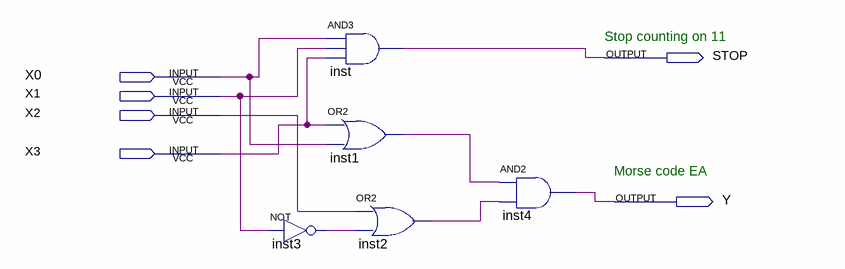
[diagram p0: schematic sheet]
// Quartus schematic KOM2.bdf as structural Verilog: 5 symbols, 6 pins
module KOM2 (
  input  X0,
  input  X1,
  input  X2,
  input  X3,
  output STOP,
  output Y
);

  wire inst1_out, inst2_out, inst3_out;

  and inst (STOP, X0, X1, X3);
  or inst1 (inst1_out, X3, X0);
  not inst3 (inst3_out, X1);
  or inst2 (inst2_out, X2, inst3_out);
  and inst4 (Y, inst1_out, inst2_out);

  // Notes on the sheet:
  //   Stop counting on 11
  //   Morse code EA
endmodule
